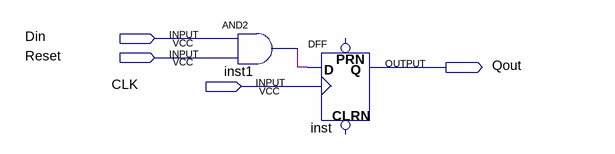
[diagram p0: schematic sheet]
// Quartus schematic SyncDFFwithSyncRst.bdf as structural Verilog: 2 symbols, 4 pins
module SyncDFFwithSyncRst (
  input  Din,
  input  Reset,
  input  CLK,
  output Qout
);

  wire inst1_out;

  and inst1 (inst1_out, Din, Reset);
  DFF inst (.CLK(CLK), .D(inst1_out), .Q(Qout));  // open: CLRN, PRN
endmodule
